# EAGLE schematic kicker3.0 (EAGLE 4.16)
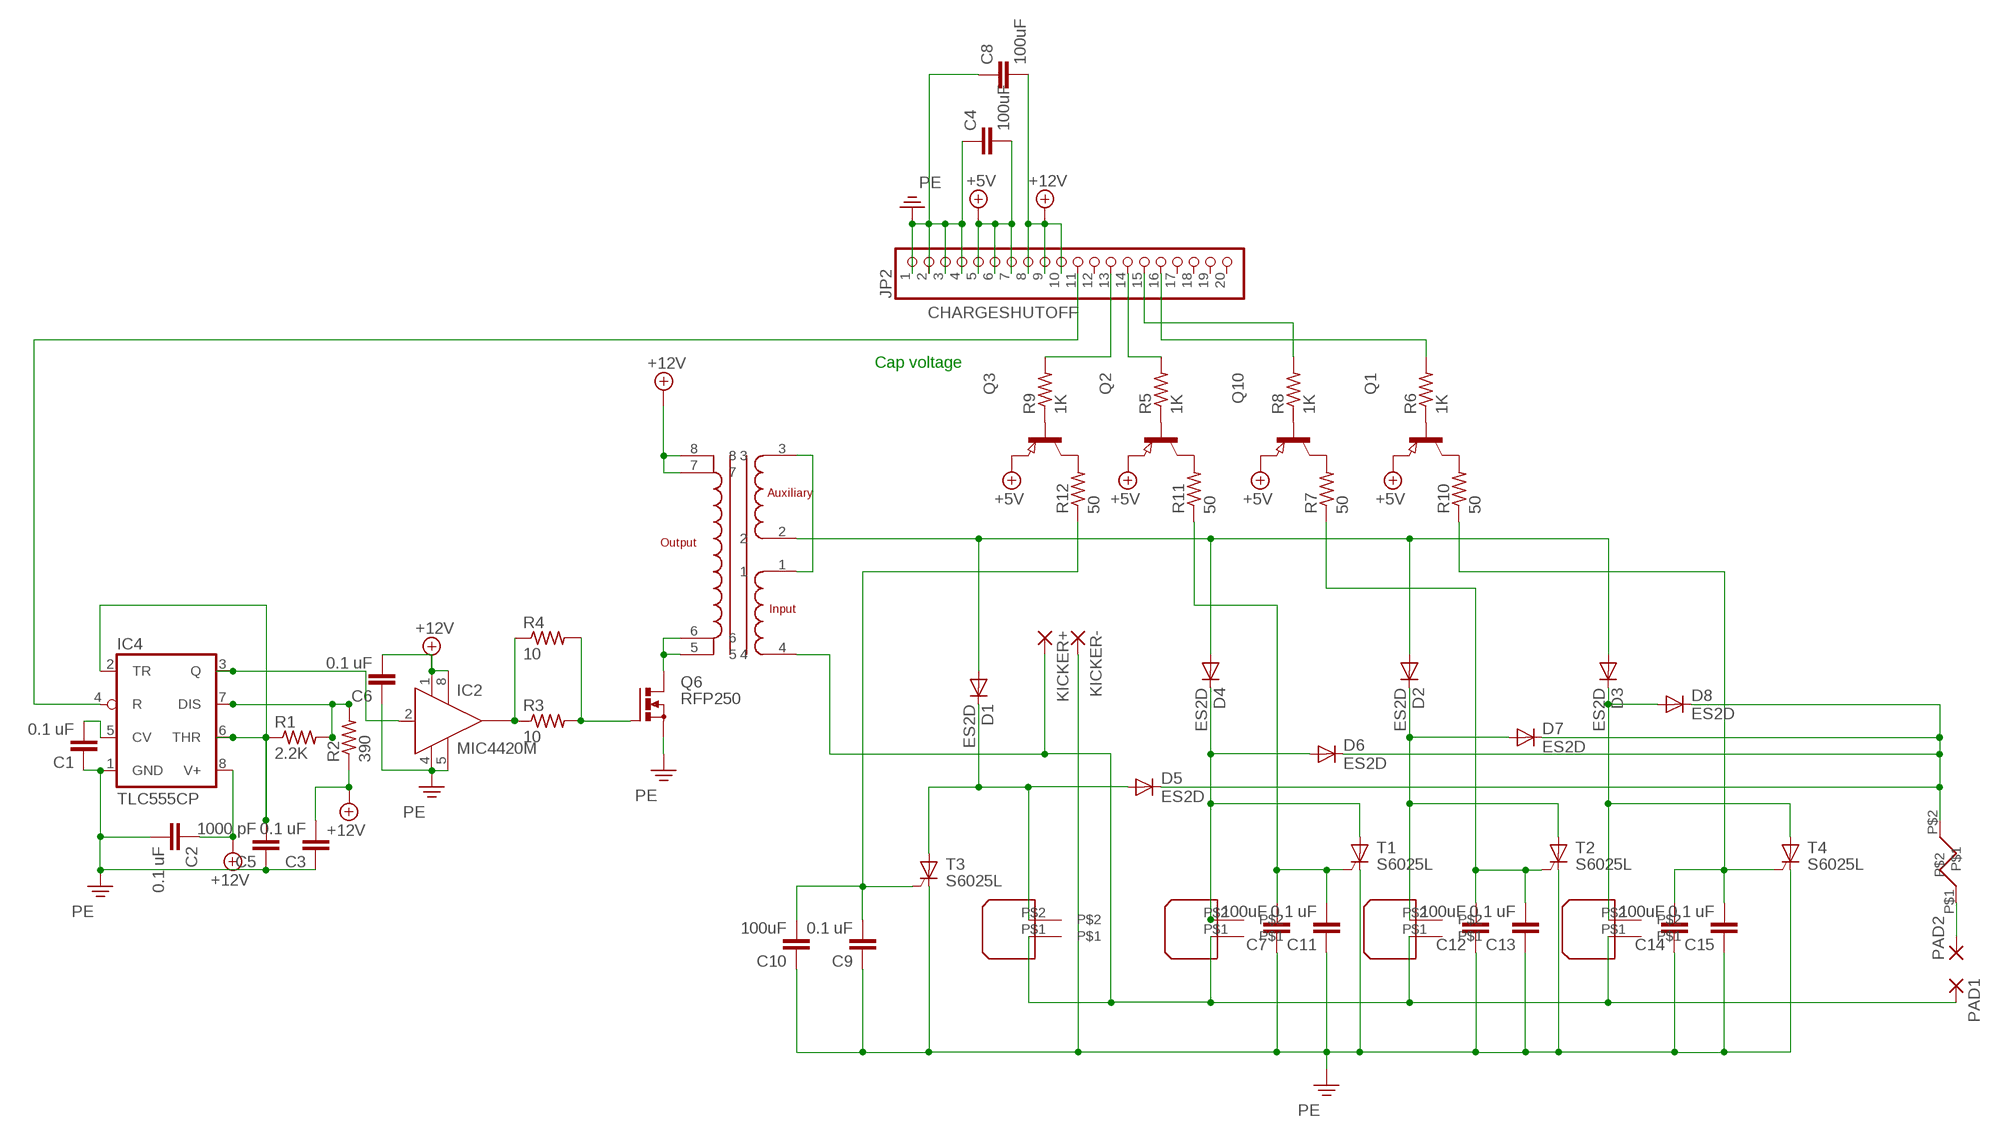
[diagram p0: schematic, sheet 1]

## Parts
C1  0.1 uF  C-EUC0805  [C0805]
C2  0.1 uF  C-EUC0805  [C0805]
C3  0.1 uF  C-EUC0805  [C0805]
C4  100uF  C-EU025-050X050  [C025-050X050]
C5  1000 pF  C-EUC0805  [C0805]
C6  0.1 uF  C-EUC0805  [C0805]
C7  100uF  C-EU025-050X050  [C025-050X050]
C8  100uF  C-EU025-050X050  [C025-050X050]
C9  0.1 uF  C-EUC0805  [C0805]
C10  100uF  C-EU025-050X050  [C025-050X050]
C11  0.1 uF  C-EUC0805  [C0805]
C12  100uF  C-EU025-050X050  [C025-050X050]
C13  0.1 uF  C-EUC0805  [C0805]
C14  100uF  C-EU025-050X050  [C025-050X050]
C15  0.1 uF  C-EUC0805  [C0805]
CAP1  2PINHEADER  [2007]
CAP2  2PINHEADER  [2007]
CAP3  2PINHEADER  [2007]
CAP4  2PINHEADER  [2007]
D1  ES2D  [SMB]
D2  ES2D  [SMB]
D3  ES2D  [SMB]
D4  ES2D  [SMB]
D5  ES2D  [SMB]
D6  ES2D  [SMB]
D7  ES2D  [SMB]
D8  ES2D  [SMB]
IC2  MIC4420M  [SO-08]
IC4  TLC555CP  LM555D  [SO08]
JP2  PINHD-1X20  [1X20]
KICKER+  1,6/0,8  [1,6/0,8]
KICKER-  1,6/0,8  [1,6/0,8]
PAD1  1,6/0,8  [1,6/0,8]
PAD2  1,6/0,8  [1,6/0,8]
Q1  PNP-TRANSISTOR_SOT23W  [SOT23W]
Q2  PNP-TRANSISTOR_SOT23W  [SOT23W]
Q3  PNP-TRANSISTOR_SOT23W  [SOT23W]
Q6  RFP250  IRFP240  [TO247BV]
Q10  PNP-TRANSISTOR_SOT23W  [SOT23W]
R1  2.2K  R-US_R0805  [R0805]
R2  390  R-US_R0805  [R0805]
R3  10  R-US_R0805  [R0805]
R4  10  R-US_R0805  [R0805]
R5  1K  R-US_R0805  [R0805]
R6  1K  R-US_R0805  [R0805]
R7  50  R-US_R0805  [R0805]
R8  1K  R-US_R0805  [R0805]
R9  1K  R-US_R0805  [R0805]
R10  50  R-US_R0805  [R0805]
R11  50  R-US_R0805  [R0805]
R12  50  R-US_R0805  [R0805]
T1  S6025L  BTV58  [TO220CS]
T2  S6025L  BTV58  [TO220CS]
T3  S6025L  BTV58  [TO220CS]
T4  S6025L  BTV58  [TO220CS]
U$1  A0009-AL  [SM]
U$2  XICON  [XICON]

## Nets
+5V: C4.2 JP2.5 JP2.6 JP2.7 Q1.2(E) Q2.2(E) Q3.2(E) Q10.2(E)
+12V: C2.1 C3.2 C6.2 C8.2 IC2.1(VS) IC2.8(VS1) IC4.8(V+) JP2.8 JP2.9 JP2.10 R2.1 U$1.7 U$1.8
CHARGESHUTOFF: IC4.4(R) JP2.11
N$1: Q6.G R3.2 R4.2
N$2: U$1.1 U$1.3
N$3: Q2.1(B) R5.1
N$4: IC2.6(OUT) R3.1 R4.1
N$5: Q6.D U$1.5 U$1.6
N$6: D1.A D2.A D3.A D4.A U$1.2
N$7: CAP2.P$2 D2.C D7.A T2.A
N$8: C9.2 C10.2 R12.1 T3.G
N$9: Q1.1(B) R6.1
N$10: CAP3.P$2 D3.C D8.A T4.A
N$12: Q3.1(B) R9.1
N$13: C12.2 C13.2 R7.1 T2.G
N$14: Q1.3(C) R10.2
N$15: Q2.3(C) R11.2
N$16: Q3.3(C) R12.2
N$17: IC4.7(DIS) R1.2 R2.2
N$18: C1.2 IC4.5(CV)
N$19: CAP1.P$1 CAP2.P$1 CAP3.P$1 CAP4.P$1 KICKER+.1(P) PAD1.1(P) U$1.4
N$20: JP2.15 R8.2
N$21: C5.2 IC4.2(TR) IC4.6(THR) R1.1
N$22: CAP1.P$2 D1.C D5.A T3.A
N$23: C7.2 C11.2 R11.1 T1.G
N$24: IC2.2(IN) IC4.3(Q)
N$25: D5.C D6.C D7.C D8.C U$2.P$2
N$26: CAP4.P$2 D4.C D6.A T1.A
N$27: PAD2.1(P) U$2.P$1
N$28: C14.2 C15.2 R10.1 T4.G
N$30: JP2.13 R9.2
N$31: Q10.3(C) R7.2
N$32: JP2.14 R5.2
N$33: JP2.16 R6.2
N$34: Q10.1(B) R8.1
PE: C1.1 C2.2 C3.1 C4.1 C5.1 C6.1 C7.1 C8.1 C9.1 C10.1 C11.1 C12.1 C13.1 C14.1 C15.1 IC2.4(GND) IC2.5(GND1) IC4.1(GND) JP2.1 JP2.2 JP2.3 JP2.4 KICKER-.1(P) Q6.S T1.C T2.C T3.C T4.C
Unconnected: IC2.7(OUT) JP2.12 JP2.17 JP2.18 JP2.19 JP2.20

## Notes on the sheet
- Cap voltage

## Library data of the parts
C1-C15 = rcl:C-EU: CAPACITOR, European symbol
CAP1-CAP4 = kickerHeader:2PINHEADER
D1-D8 = diode:ES2D: DIODE super fast rectifier, 2 A
IC2 = transistor-power:MIC4420: 6A-Peak Low-Side MOSFET Driver Bipolar/CMOS/DMOS Process http://www.micrel.com/_PDF/mic4420.pdf
IC4 = linear:*555: TIMER
JP2 = pinhead:PINHD-1X20: PIN HEADER
KICKER+ KICKER- PAD1 PAD2 = wirepad:1,6/0,8: THROUGH-HOLE PAD
Q1-Q3 Q10 = semicon-smd-ipc:PNP-TRANSISTOR_: PNP TRANSISTOR
Q6 = transistor-power:IRFP240: HEXFET Power MosFet Source: http://www.irf.com/
R1-R12 = rcl:R-US_: RESISTOR, American symbol
T1-T4 = triac:BTV58: THYRISTOR
U$1 = Kicker:A0009-AL
U$2 = robocup:XICON